# Altium schematic sheet [06] Power Supply.SchDoc: Power Supply
size A4; Organization: Blinkinlabs, LLC; DocumentNumber: 6; SheetNumber: 6; SheetTotal: 7
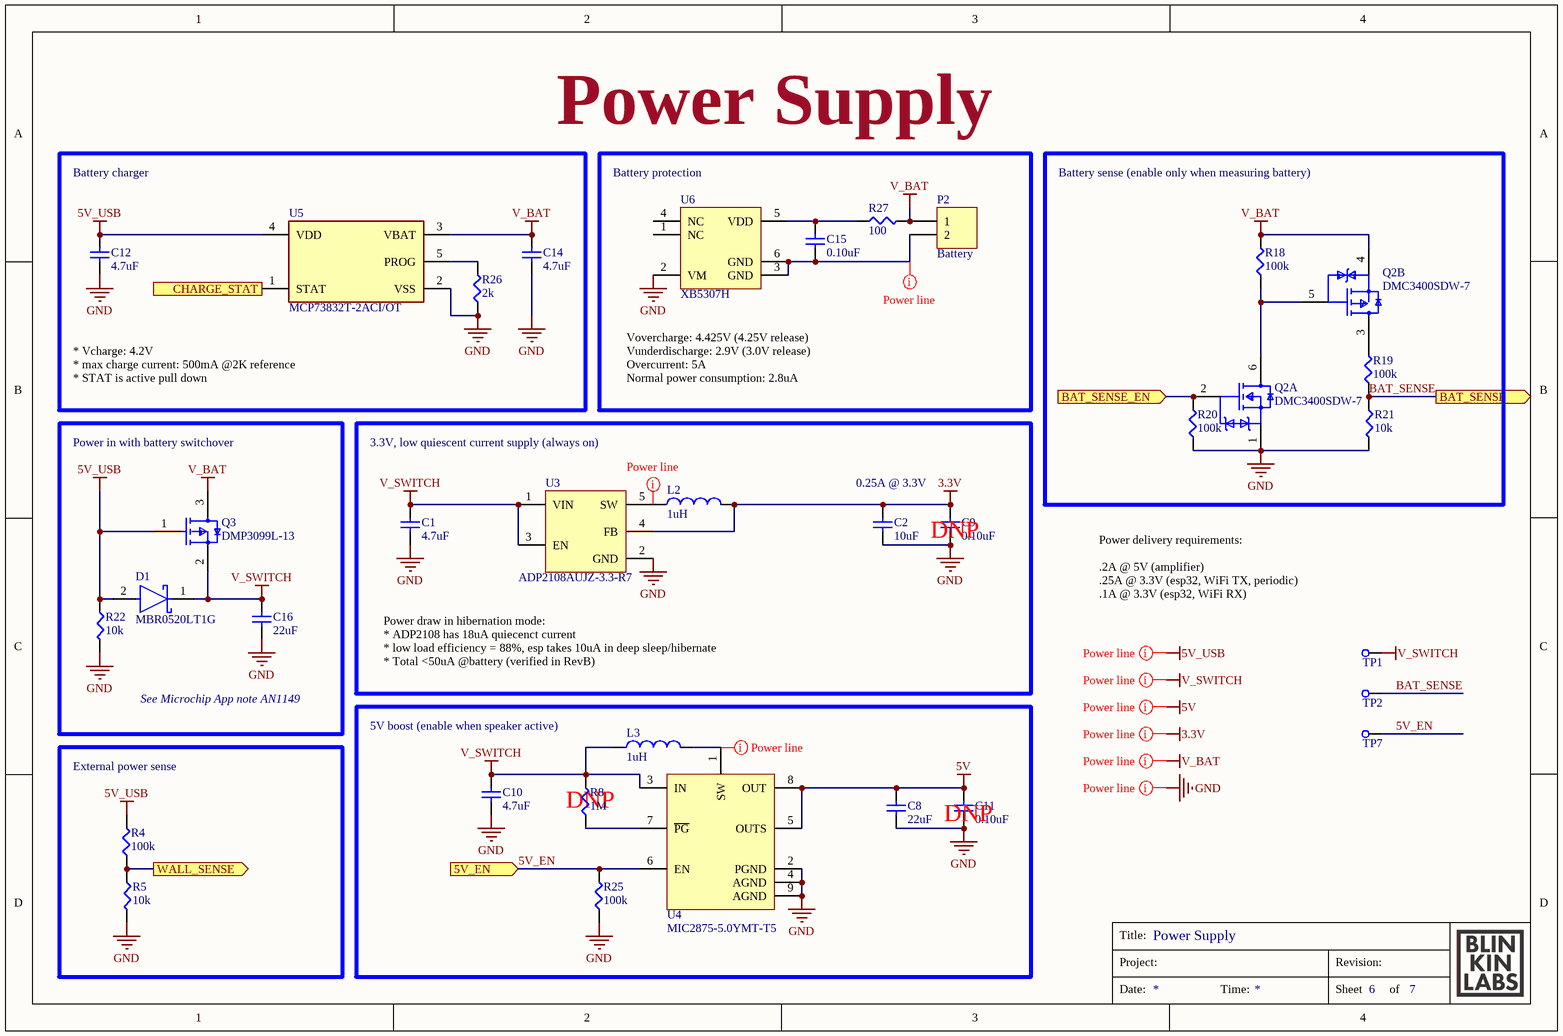
[diagram p0: [06] Power Supply.SchDoc]

## Parts
C1  4.7uF  [CAPC1608X09L]
C2  10uF  [CAPC1608X09L]
C8  22uF  [CAPC1608X09L]
C9  0.10uF  [CAPC1005X06L]
C10  4.7uF  [CAPC1608X09L]
C11  0.10uF  [CAPC1005X06L]
C12  4.7uF  [CAPC1608X09L]
C14  4.7uF  [CAPC1608X09L]
C15  0.10uF  [CAPC1005X06L]
C16  22uF  [CAPC1608X09L]
D1  MBR0520LT1G  [FP-425-04-IPC_C]
L2  1uH  [FNR201610S]
L3  1uH  [FNR201610S]
P2  Battery  [HDR1X2]
Q2  DMC3400SDW-7  [FP-SOT363-MFG]  (parts A,B of 2)
Q3  DMP3099L-13  [FP-SOT23-IPC_A]
R4  100k  [ERJ2G(0402)_L]
R5  10k  [ERJ2G(0402)_L]
R8  1M  [ERJ2G(0402)_L]
R18  100k  [ERJ2G(0402)_L]
R19  100k  [ERJ2G(0402)_L]
R20  100k  [ERJ2G(0402)_L]
R21  10k  [ERJ2G(0402)_L]
R22  10k  [ERJ2G(0402)_L]
R25  100k  [ERJ2G(0402)_L]
R26  2k  [ERJ2G(0402)_L]
R27  100  [ERJ2G(0402)_L]
TP1  TEST_POINT  [TP-SMD-1mm]  (value not drawn)  (no BOM)
TP2  TEST_POINT  [TP-SMD-1mm]  (value not drawn)  (no BOM)
TP7  TEST_POINT  [TP-SMD-1mm]  (value not drawn)  (no BOM)
U3  ADP2108AUJZ-3.3-R7  [SOT95P280X100-5N]
U4  MIC2875-5.0YMT-T5  [TDFN22-8LD-PL-1 (hand drawn)]
U5  MCP73832T-2ACI/OT  [FP-C04-091-OT-MFG]
U6  XB5307H  [SOT95P280X125-6N-3]

## Blocks framed on the sheet
Battery charger: C12 C14 R26 U5
Battery protection: C15 P2 R27 U6
Battery sense (enable only when measuring battery): Q2 R18-R21
DNP: C1 C2 C9 L2 U3
External power sense: R4 R5

## Ports
5V_EN (in), BAT_SENSE (out), BAT_SENSE_EN (in), CHARGE_STAT (out), WALL_SENSE (out)

## Nets
3.3V: C2.1 C9.2 L2.2 U3.4(FB)
5V: C8.1 C11.2 U4.5(OUTS) U4.8(OUT)
5V_USB: C12.1 D1.2(A) Q3.1(G) R4.2 R22.1 U5.4(VDD)
GND: C1.2 C2.2 C8.2 C9.1 C10.2 C11.1 C12.2 C14.2 C16.2 Q2.1(S1) R5.2 R20.1 R21.2 R22.2 R25.1 R26.1 U3.2(GND) U4.2(PGND) U4.4(AGND) U4.9(AGND) U5.2(VSS) U6.2(VM)
V_BAT: C14.1 P2.1 Q2.4(S2) Q3.3(D) R18.2 R27.2 U5.3(VBAT)
V_SWITCH: C1.1 C10.1 C16.1 D1.1(C) L3.1 Q3.2(S) R8.2 TP1.1(TP) U3.1(VIN) U3.3(EN) U4.3(IN)
5V_EN: R25.2 TP7.1(TP) U4.6(EN) ; port 5V_EN
BAT_SENSE: R19.1 R21.1 TP2.1(TP) ; port BAT_SENSE
BAT_SENSE_EN: Q2.2(G1) R20.2 ; port BAT_SENSE_EN
CHARGE_STAT: U5.1(STAT) ; port CHARGE_STAT
WALL_SENSE: R4.1 R5.1 ; port WALL_SENSE
NetC15_1: C15.1 P2.2 U6.3(GND) U6.6(GND)
NetC15_2: C15.2 R27.1 U6.5(VDD)
NetL2_1: L2.1 U3.5(SW)
NetL3_2: L3.2 U4.1(SW)
NetQ2_3: Q2.3(D2) R19.2
NetQ2_5: Q2.5(G2) Q2.6(D1) R18.1
NetR8_1: R8.1 U4.7(~{PG})
NetR26_2: R26.2 U5.5(PROG)

Not connected (* = marked no-connect by the designer): U6 1(NC) 4(NC)

## Layout directives
net class POWER: 3.3V, 5V, 5V_USB, GND, NetC15_1, NetL2_1, NetL3_2, V_BAT, V_SWITCH

## Notes on the sheet
- Vovercharge: 4.425V (4.25V release)
  Vunderdischarge: 2.9V (3.0V release)
  Overcurrent: 5A
  Normal power consumption: 2.8uA
- Power in with battery switchover
- * Vcharge: 4.2V
  * max charge current: 500mA @2K reference
  * STAT is active pull down
- 3.3V, low quiescent current supply (always on)
- 0.25A @ 3.3V
- (near TP1) Power delivery requirements:
  .2A @ 5V (amplifier)
  .25A @ 3.3V (esp32, WiFi TX, periodic)
  .1A @ 3.3V (esp32, WiFi RX)
- See Microchip App note AN1149
- Power draw in hibernation mode:
  * ADP2108 has 18uA quiecenct current
  * low load efficiency = 88%, esp takes 10uA in deep sleep/hibernate
  * Total <50uA @battery (verified in RevB)
- 5V boost (enable when speaker active)
- (near R8) DNP
- (near C11) DNP
- Labels drawn without touching a wire or pin: 3.3V, 5V, 5V_USB, GND, V_BAT, V_SWITCH
- Title:
- Project:
- Revision:
- Date:
- Time:
- Sheet
- of

## Library data of the parts
C1 C10 C12 C14 = GRM188R61A475KE15D: CAP CER 4.7UF 10V X5R 0603; Manufacturer: Murata Electronics North America; Tolerance: ±10%; PartNumber: GRM188R61A475KE15D; Datasheets: http://www.murata.com/~/media/webrenewal/support/library/catalog/products/capacitor/mlcc/c02e.pdf; Image: //media.digikey.com/Renders/Murata%20Renders/ZRB-SERIES-0402.jpg; Digi-Key Part Number: 490-10477-1-ND; Series: GRM; Value: 4.7uF; Voltage: 10V; Temperature Coefficient: X5R; Operating Temperature: -55°C ~ 85°C; Features: Derating Recommended; Applications: General Purpose; Package / Case: 0603 (1608 Metric); Case/Package: 0603
C2 = GRM188R61A106KE69D: CAP CER 10UF 10V X5R 0603; Manufacturer: Murata Electronics North America; Tolerance: ±10%; PartNumber: GRM188R61A106KE69D; Datasheets: http://www.murata.com/~/media/webrenewal/support/library/catalog/products/capacitor/mlcc/c02e.pdf; Image: //media.digikey.com/Renders/Murata%20Renders/ZRB-SERIES-0402.jpg; Digi-Key Part Number: 490-10474-1-ND; Series: GRM; Value: 10uF; Voltage: 10V; Temperature Coefficient: X5R; Operating Temperature: -55°C ~ 85°C; Features: Derating Recommended; Applications: General Purpose; Package / Case: 0603 (1608 Metric); Case/Package: 0603
C8 C16 = GRM187R61A226ME15D: CAP CER 22UF 10V X5R 0603; Manufacturer: Murata Electronics North America; Tolerance: ±20%; PartNumber: GRM187R61A226ME15D; Datasheets: http://psearch.en.murata.com/capacitor/product/GRM187R61A226ME15%23.pdf; Image: //media.digikey.com/Renders/Murata%20Renders/ZRB-SERIES-0402.jpg; Digi-Key Part Number: 490-13243-1-ND; Series: GRM; Value: 22uF; Voltage: 10V; Temperature Coefficient: X5R; Operating Temperature: -55°C ~ 85°C; Features: Derating Recommended; Applications: General Purpose; Package / Case: 0603 (1608 Metric); Case/Package: 0603
C9 C11 C15 = GRM155R61C104KA88J: CAP CER 0.1UF 16V X5R 0402; Manufacturer: Murata Electronics North America; Tolerance: ±10%; PartNumber: GRM155R61C104KA88J; Datasheets: http://www.murata.com/~/media/webrenewal/support/library/catalog/products/capacitor/mlcc/c02e.pdf; Image: //media.digikey.com/Renders/Murata%20Renders/ZRB-SERIES-0402.jpg; Digi-Key Part Number: 490-6310-1-ND; Packaging: Cut Tape (CT); Series: GRM; Value: 0.10uF; Voltage: 16V; Temperature Coefficient: X5R; Operating Temperature: -55°C ~ 85°C; Features: -; Applications: General Purpose; Package / Case: 0402 (1005 Metric); Case/Package: 0402
D1 = CMP-1055-00425-2: DIODE SCHOTTKY 20V 500MA SOD123; Polarity: Standard; Peak Non-Repetitive Surge Current: 5.5A; Forward Voltage: 385mV; Element Configuration: Single; Peak Reverse Current: 250uA; Max Repetitive Reverse Voltage (Vrrm): 20V; Voltage Rating (DC): 20V; Case/Package: SOD-123-2; Number of Pins: 2; Output Current: 500mA; Min Operating Temperature: -65°C; Lead Free: Lead Free; REACH SVHC: No SVHC; Max Reverse Voltage (DC): 20V; Termination: SMD/SMT; Average Rectified Current: 500mA; Max Surge Current: 5.5A; Package Quantity: 3000; Height: 1.12mm; Current Rating: 500mA; Forward Current: 500mA; Max Forward Surge Current (Ifsm): 5.5A; Packaging: Tape and Reel; Length: 2.69mm; Radiation Hardening: No; Max Reverse Leakage Current: 250uA; Width: 1.6mm; Contact Plating: Tin; Max Operating Temperature: 125°C
L2 L3 = FNR201610S1R0MT: 1uH ±20% 1.45A 114mΩ SMD,2.0x1.6x1.0mm Power Inductors RoHS; Manufacturer: Changjiang Microelectronics Tech; PartNumber: FNR201610S1R0MT; Datasheets: https://datasheet.lcsc.com/szlcsc/1805291223_cjiang-Changjiang-Microelectronics-Tech-FNR201610S1R0MT_C167670.pdf; LCSC PartNumber: C167670; Inductance: 1uH; Tolerance: ±20%; DC Resistance: 114mΩ; Saturation current: 1.45A; Packaging: Cut Tape (CT); Package / Case: SMD,2.0x1.6x1.0mm; Case/Package: SMD,2.0x1.6x1.0mm
P2 = Header 2: Header, 2-Pin; LatestRevisionDate: 17-Jul-2002; LatestRevisionNote: Re-released for DXP Platform.; Publisher: Altium Limited
Q2 = CMP-12801-000006-1: MOSFET N/P-CH 30V SOT363; Manufacturer: Diodes Inc.; Standoff Height: 0mm; Number Of Channels: 2; Pulse Drain Current: 4/-3A; Max Forward Diode Voltage: 1.2/-1.2V; Max Junction Temp: +150°C; Drain To Source Resistance: 0.2/0.36Ω; Depletion Mode: False; Continuous Drain Current: 0.65/-0.45A; Number Of P Channels: 1; Drain To Source Breakdown Voltage: 30/-30V; Rthja Max: 406°C/W; Gate To Source Voltage: 20V; Power Dissipation: 0.31W; Turn On Delay Time: 3.8/5.7ns; Threshold Vgs Min: 0.8/-1V; Typ Forward Diode Voltage: 0.8/-0.8V; Turn Off Delay Time: 25.2/35ns; Threshold Vgs Max: 1.6/-2.6V; Lead Free: Yes; Temperature: -55°C to +150°C; Package: SOT363; Temperature Range High: +150°C; Height: 1.1mm; Device Class L2: Transistors; RoHS: TRUE; Category: Trans; Mouser Description: MOSFET 30V Comp Pair Enh 20Vgs 55pF 0.6nC; Device Class L3: MOSFETs; ComponentLink2Description: Datasheet; Automotive: No; ComponentLink2URL: https://www.diodes.com/assets/Datasheets/DMC3400SDW.pdf; Number Of N Channels: 1; Footprint Url: https://www.diodes.com/assets/Package-Files/SOT363.pdf; Digikey Description: MOSFET N/P-CH 30V SOT363; Device Class L1: Discrete Semiconductors; Manufacturer Part Number: DMC3400SDW-7; Drain To Source Voltage: 30/-30V; Ipc Land Pattern Name: SOT65P210X100-6; Temperature Range Low: -55°C; Octopart: https://octopart.com/dmc3400sdw-7-diodes+inc.-57605013
Q3 = CMP-12801-000102-1: MOSFET P-CH 30V 3.8A SOT23; Fall Time: 15ns; Turn-Off Delay Time: 31ns; Rds On Max: 65mR; Rise Time: 5ns; Gate to Source Voltage (Vgs): 20V; Number of Channels: 1; Max Power Dissipation: 1.08W; Turn-On Delay Time: 4.8ns; Element Configuration: Single; Input Capacitance: 563pF; Weight: 0.000282oz; Case/Package: TO-236-3; Drain to Source Voltage (Vdss): 30V; Package Quantity: 10000; Min Operating Temperature: -55°C; Radiation Hardening: No; REACH SVHC: No SVHC; Drain to Source Resistance: 65mR; Packaging: Tape and Reel; Lead Free: Lead Free; Number of Pins: 3; Mount: Surface Mount; Max Operating Temperature: 150°C; Continuous Drain Current (ID): 3.8A
R4 R18-R20 R25 = ERJ-2GEJ104X: RES SMD 100K OHM 5% 1/10W 0402; Manufacturer: Panasonic Electronic Components; Power (Watts): 0.1W, 1/10W; Temperature Coefficient: ±200ppm/°C; PartNumber: ERJ-2GEJ104X; Datasheets: http://industrial.panasonic.com/www-cgi/jvcr13pz.cgi?E+PZ+3+AOA0001+ERJ2GEJ104X+7+WW; Image: //media.digikey.com/Photos/Panasonic%20Photos/ERJ-PA2-Series.jpg; Digi-Key Part Number: P100KJCT-ND; Series: ERJ; Value: 100k; Tolerance: ±5%; Composition: Thick Film; Features: Automotive AEC-Q200; Operating Temperature: -55°C ~ 155°C; Package / Case: 0402 (1005 Metric); Case/Package: 0402; Size / Dimension: 0.039" L x 0.020" W (1.00mm x 0.50mm); Height - Seated (Max): 0.016" (0.40mm); Number of Terminations: 2
R5 R21 R22 = ERJ-2GEJ103X: RES SMD 10K OHM 5% 1/10W 0402; Manufacturer: Panasonic Electronic Components; Power (Watts): 0.1W, 1/10W; Temperature Coefficient: ±200ppm/°C; PartNumber: ERJ-2GEJ103X; Datasheets: http://industrial.panasonic.com/www-cgi/jvcr13pz.cgi?E+PZ+3+AOA0001+ERJ2GEJ103X+7+WW; Image: //media.digikey.com/Photos/Panasonic%20Photos/ERJ-PA2-Series.jpg; Digi-Key Part Number: P10KJCT-ND; Series: ERJ; Value: 10k; Tolerance: ±5%; Composition: Thick Film; Features: Automotive AEC-Q200; Operating Temperature: -55°C ~ 155°C; Package / Case: 0402 (1005 Metric); Case/Package: 0402; Size / Dimension: 0.039" L x 0.020" W (1.00mm x 0.50mm); Height - Seated (Max): 0.016" (0.40mm); Number of Terminations: 2
R8 = ERJ-2GEJ105X: RES SMD 1M OHM 5% 1/10W 0402; Manufacturer: Panasonic Electronic Components; Power (Watts): 0.1W, 1/10W; Temperature Coefficient: ±200ppm/°C; PartNumber: ERJ-2GEJ105X; Datasheets: http://industrial.panasonic.com/www-cgi/jvcr13pz.cgi?E+PZ+3+AOA0001+ERJ2GEJ105X+7+WW; Image: //media.digikey.com/Photos/Panasonic%20Photos/ERJ-PA2-Series.jpg; Digi-Key Part Number: P1.0MJCT-ND; Series: ERJ; Value: 1M; Tolerance: ±5%; Composition: Thick Film; Features: Automotive AEC-Q200; Operating Temperature: -55°C ~ 155°C; Package / Case: 0402 (1005 Metric); Case/Package: 0402; Size / Dimension: 0.039" L x 0.020" W (1.00mm x 0.50mm); Height - Seated (Max): 0.016" (0.40mm); Number of Terminations: 2
R26 = ERJ-2GEJ202X: RES SMD 2K OHM 5% 1/10W 0402; Manufacturer: Panasonic Electronic Components; Power (Watts): 0.1W, 1/10W; Temperature Coefficient: ±200ppm/°C; PartNumber: ERJ-2GEJ202X; Datasheets: http://industrial.panasonic.com/www-cgi/jvcr13pz.cgi?E+PZ+3+AOA0001+ERJ2GEJ202X+7+WW; Image: //media.digikey.com/Photos/Panasonic%20Photos/ERJ-PA2-Series.jpg; Digi-Key Part Number: P2.0KJCT-ND; Series: ERJ; Value: 2k; Tolerance: ±5%; Composition: Thick Film; Features: Automotive AEC-Q200; Operating Temperature: -55°C ~ 155°C; Package / Case: 0402 (1005 Metric); Case/Package: 0402; Size / Dimension: 0.039" L x 0.020" W (1.00mm x 0.50mm); Height - Seated (Max): 0.016" (0.40mm); Number of Terminations: 2
R27 = ERJ-2RKF1000X: RES SMD 100 OHM 1% 1/10W 0402; Manufacturer: Panasonic Electronic Components; Power (Watts): 0.1W, 1/10W; Temperature Coefficient: ±100ppm/°C; PartNumber: ERJ-2RKF1000X; Datasheets: http://industrial.panasonic.com/www-cgi/jvcr13pz.cgi?E+PZ+3+AOA0002+ERJ2RKF1000X+7+WW; Image: //media.digikey.com/Photos/Panasonic%20Photos/ERJ-PA2-Series.jpg; Digi-Key Part Number: P100LCT-ND; Series: ERJ; Value: 100; Tolerance: ±1%; Composition: Thick Film; Features: Automotive AEC-Q200; Operating Temperature: -55°C ~ 155°C; Package / Case: 0402 (1005 Metric); Case/Package: 0402; Size / Dimension: 0.039" L x 0.020" W (1.00mm x 0.50mm); Height - Seated (Max): 0.016" (0.40mm); Number of Terminations: 2
TP1 TP2 TP7 = TEST_POINT: Test point
U3 = ADP2108AUJZ-3.3-R7: Compact, 600 mA, 3 MHz, Step-Down DC-to-DC Converter, 3.3V; Manufacturer: *; PartNumber: ADP2108AUJZ-3.3-R7; DigiKey PartNumber: ADP2108AUJZ-3.3-R7CT-ND; LCSC PartNumber: C143875
U4 = MIC2875-5.0YMT-T5: 4.8A ISW, Synchronous Boost Regulator with Bi-Directional Load Disconnect; Manufacturer: Microchip; PartNumber: MIC2875-5.0YMT-T5; Digikey PartNumber: MIC2875-5.0YMT-T5CT-ND
U5 = CMP-0133-00138-2: IC LI-ION/LI-POLY CTRLR SOT23-5; Output Current: 10mA; Output Voltage: 4.2V; Max Output Current: 500mA; Max Power Dissipation: 1.54W; Min Output Voltage: 4.168V; Number of Channels: 1; Max Supply Voltage: 6V; Min Supply Voltage: 3.75V; Max Output Voltage: 4.5V; Case/Package: SOT-23; Lead Free: Lead Free; Termination: SMD/SMT; Min Operating Temperature: -40°C; Max Operating Temperature: 85°C; Height: 1.3mm; Length: 3.1mm; Mount: Surface Mount; Package Quantity: 3000; Number of Pins: 5; Packaging: Tape and Reel; REACH SVHC: No SVHC; Contact Plating: Tin; Width: 1.8mm; Number of Cells: 1; Number of Outputs: 1; Power Dissipation: 1.54W; Max Charge Current: 500mA; Max Input Voltage: 6V; Radiation Hardening: No
U6 = XB5307H: Single-cell Li-ion/Li-polymer rechargeable battery pack protection chip w2.90V cutorff; Manufacturer: XySemi; PartNumber: XB5307H; LCSC PartNumber: C154942